# EAGLE design Stereo RDS Encoder-Analog Board (EAGLE 9.6.2)
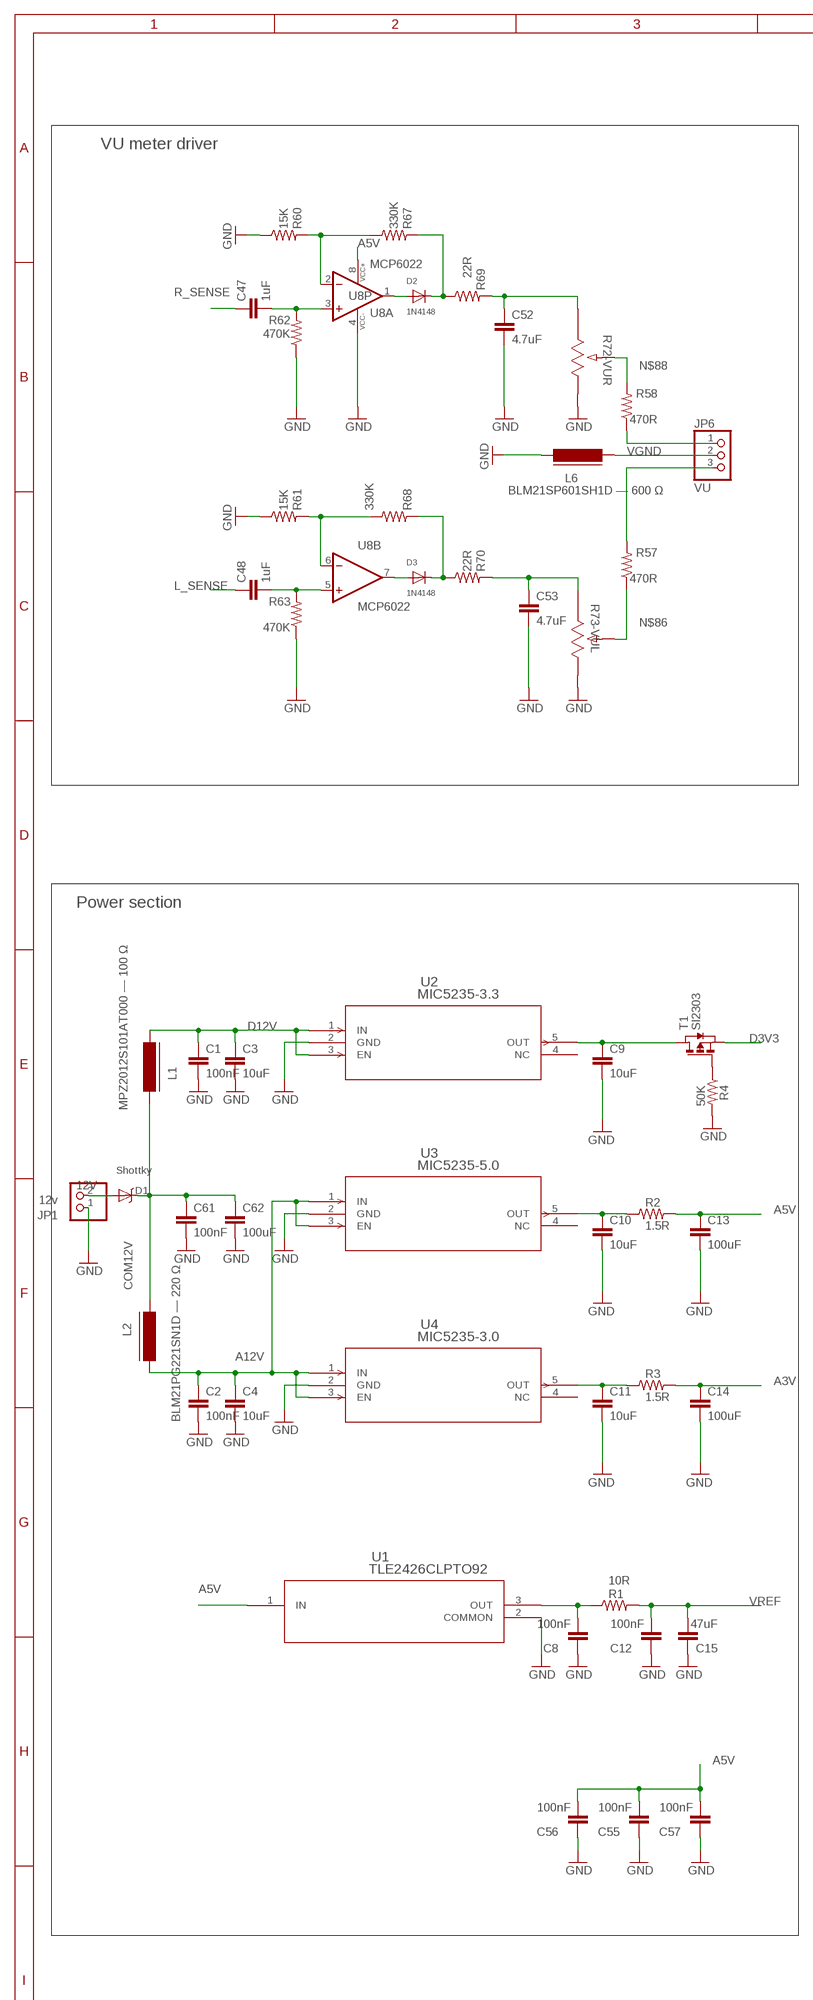
[diagram p0: schematic, sheet 1, part 1 of 2]
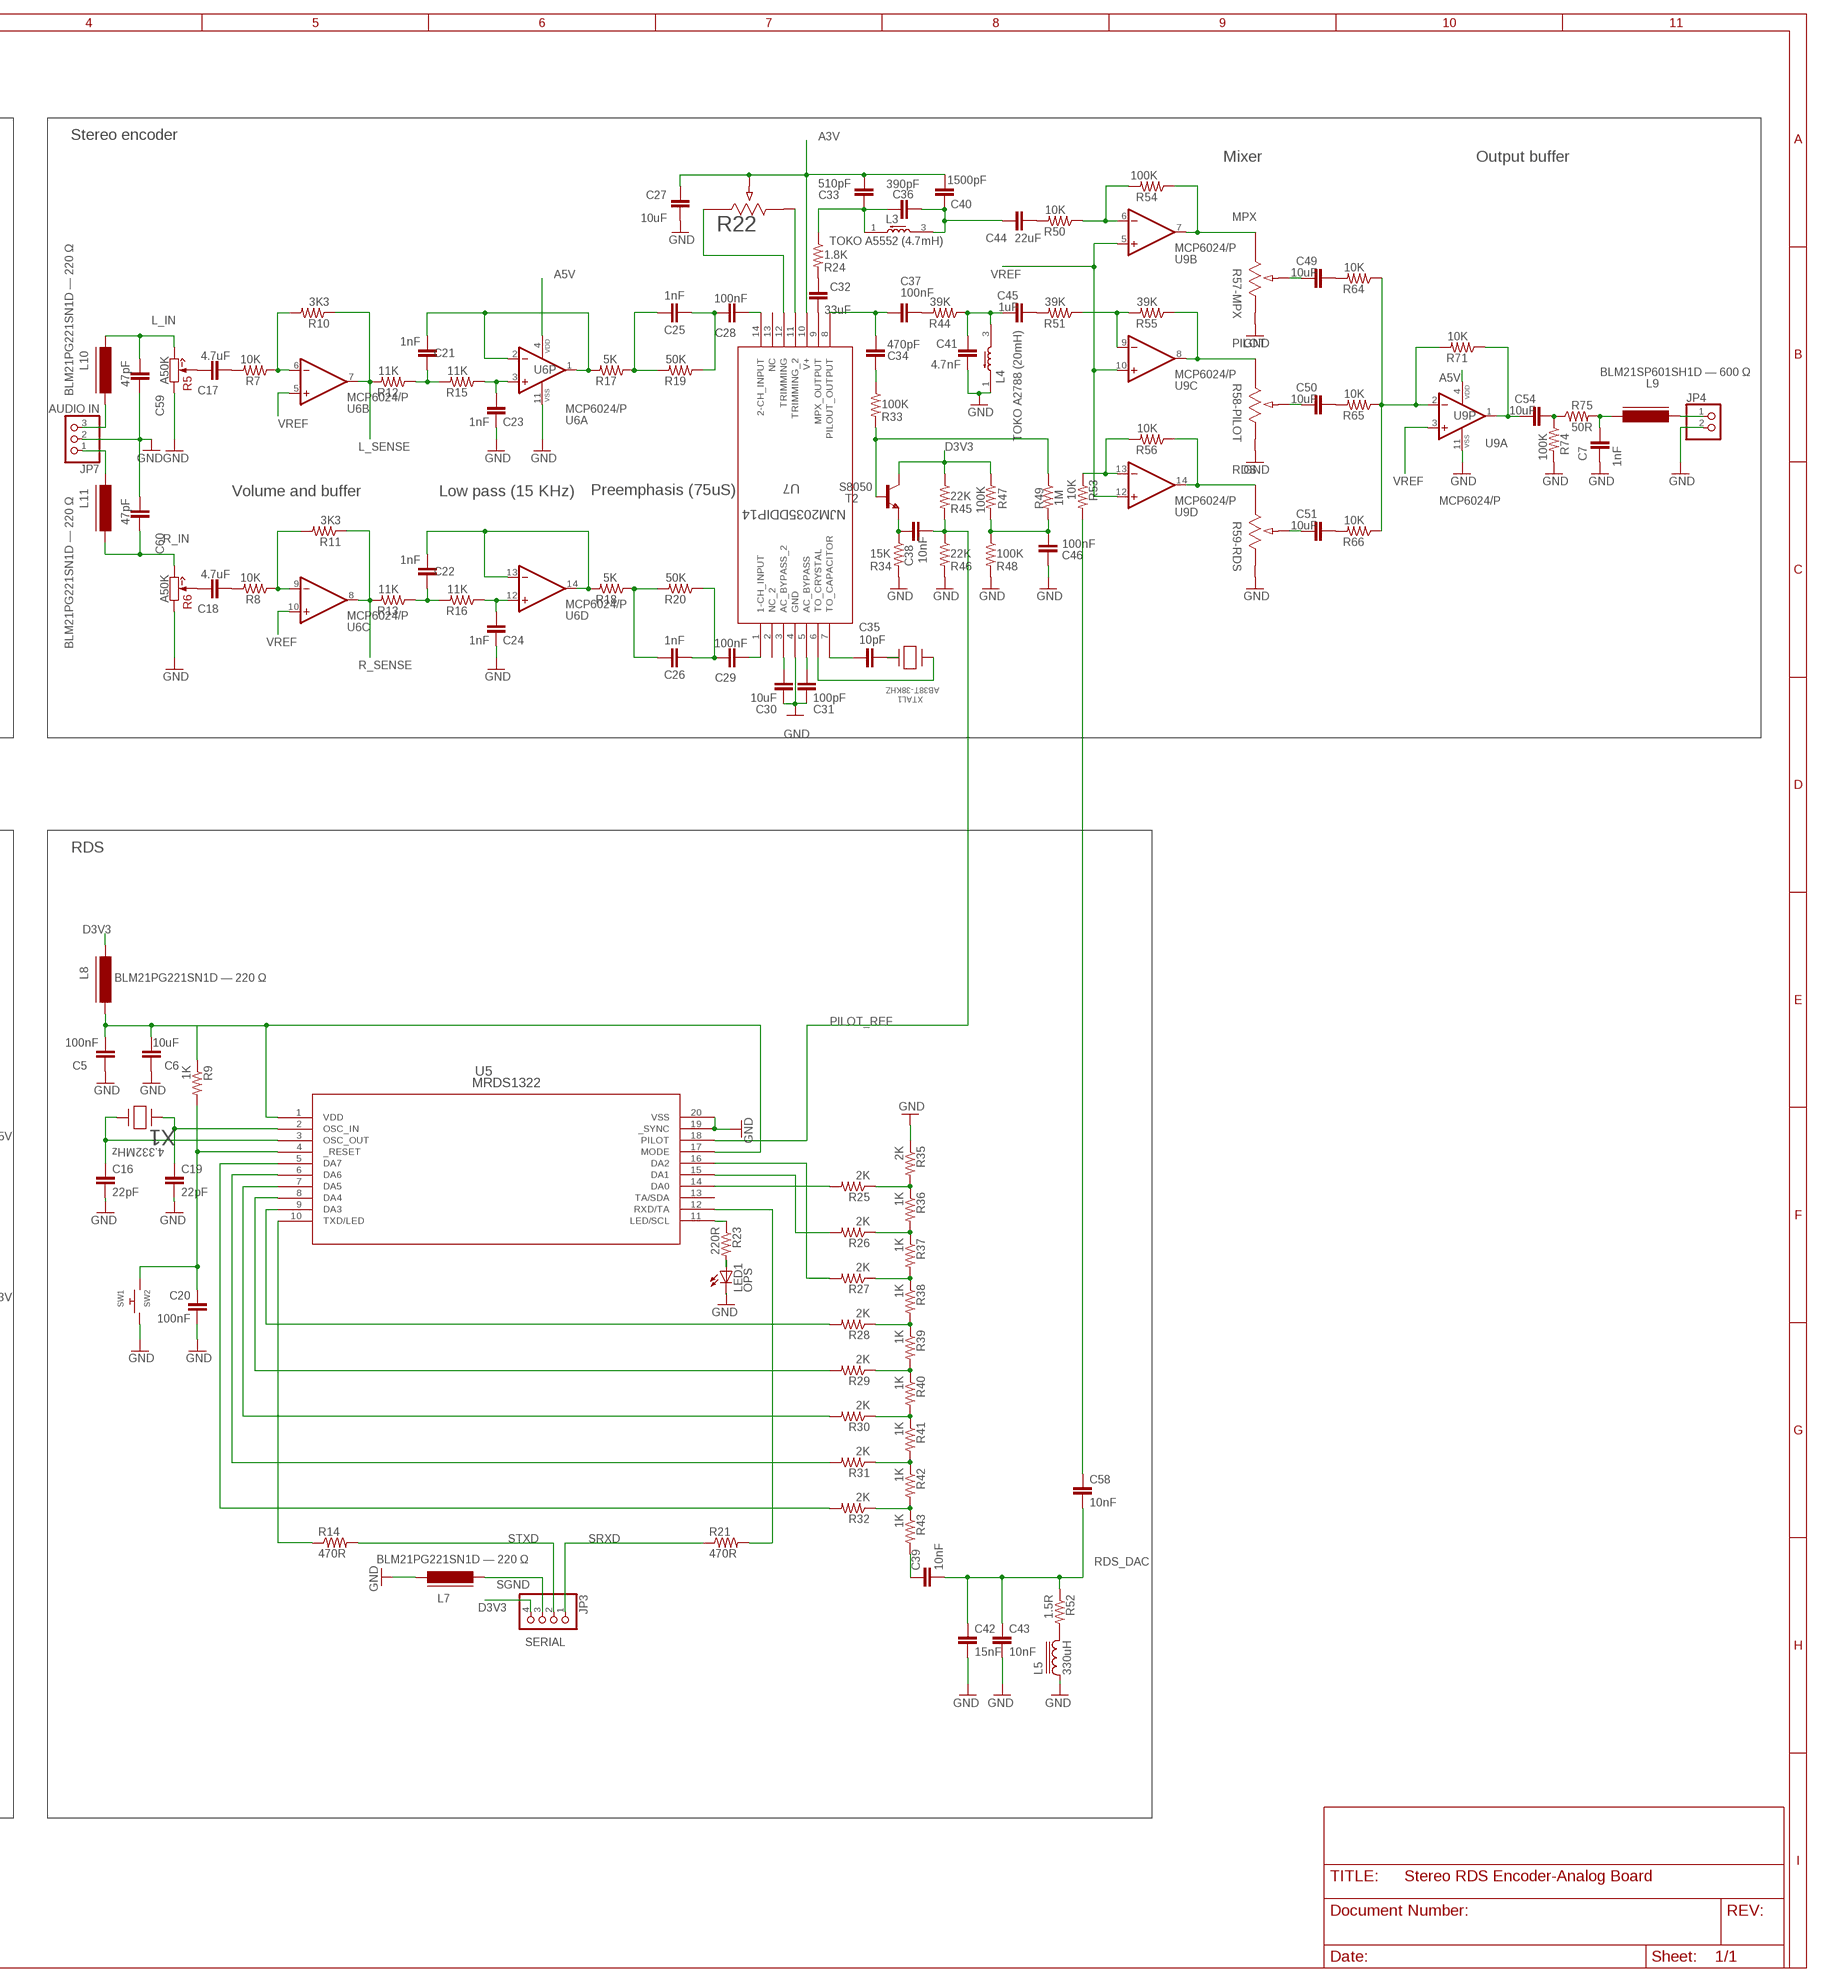
[diagram p1: schematic, sheet 1, part 2 of 2]

## Parts
C1  100nF  C-EUC0805  [C0805]
C2  100nF  C-EUC0805  [C0805]
C3  10uF  C-EUC0805  [C0805]
C4  10uF  C-EUC0805  [C0805]
C5  100nF  C-EUC0805  [C0805]
C6  10uF  C-EUC0805  [C0805]
C7  1nF  C-EUC0805  [C0805]
C8  100nF  C-EUC0805  [C0805]
C9  10uF  C-EUC0805  [C0805]
C10  10uF  C-EUC0805  [C0805]
C11  10uF  C-EUC0805  [C0805]
C12  100nF  C-EUC0805  [C0805]
C13  100uF  C-EUC0805  [C0805]
C14  100uF  C-EUC0805  [C0805]
C15  47uF  C-EUC0805  [C0805]
C16  22pF  C-EUC0805  [C0805]
C17  4.7uF  C-EUC0805  [C0805]
C18  4.7uF  C-EUC0805  [C0805]
C19  22pF  C-EUC0805  [C0805]
C20  100nF  C-EUC0805  [C0805]
C21  1nF  C-EUC0805  [C0805]
C22  1nF  C-EUC0805  [C0805]
C23  1nF  C-EUC0805  [C0805]
C24  1nF  C-EUC0805  [C0805]
C25  1nF  C-EUC0805  [C0805]
C26  1nF  C-EUC0805  [C0805]
C27  10uF  C-EUC0805  [C0805]
C28  100nF  C-EUC0805  [C0805]
C29  100nF  C-EUC0805  [C0805]
C30  10uF  C-EUC0805  [C0805]
C31  100pF  C-EUC0805  [C0805]
C32  33uF  C-EUC0805  [C0805]
C33  510pF  C-EUC0805  [C0805]
C34  470pF  C-EUC0805  [C0805]
C35  10pF  C-EUC0805  [C0805]
C36  390pF  C-EUC0805  [C0805]
C37  100nF  C-EUC0805  [C0805]
C38  10nF  C-EUC0805  [C0805]
C39  10nF  C-EUC0805  [C0805]
C40  1500pF  C-EUC0805  [C0805]
C41  4.7nF  C-EUC0805  [C0805]
C42  15nF  C-EUC0805  [C0805]
C43  10nF  C-EUC0805  [C0805]
C44  22uF  C-EUC0805  [C0805]
C45  1uF  C-EUC0805  [C0805]
C46  100nF  C-EUC0805  [C0805]
C47  1uF  C-EUC0805  [C0805]
C48  1uF  C-EUC0805  [C0805]
C49  10uF  C-EUC0805  [C0805]
C50  10uF  C-EUC0805  [C0805]
C51  10uF  C-EUC0805  [C0805]
C52  4.7uF  C-EUC0805  [C0805]
C53  4.7uF  C-EUC0805  [C0805]
C54  10uF  C-EUC0805  [C0805]
C55  100nF  C-EUC0805  [C0805]
C56  100nF  C-EUC0805  [C0805]
C57  100nF  C-EUC0805  [C0805]
C58  10nF  C-EUC0805  [C0805]
C59  47pF  C-EUC0805  [C0805]
C60  47pF  C-EUC0805  [C0805]
C61  100nF  C-EUC0805  [C0805]
C62  100uF  C-EUC0805  [C0805]
D1  Shottky  DIODE-SCHOTTKYSMA-403D  [SMA-403D]
D2  1N4148  DIODESOD-323F  [SOD-323F]
D3  1N4148  DIODESOD-323F  [SOD-323F]
JP1  12v  PINHD-1X2  [1X02]
JP3  SERIAL  PINHD-1X4  [1X04]
JP4  PINHD-1X2  [1X02]
JP6  VU  PINHD-1X3  [1X03]
JP7  AUDIO IN  PINHD-1X3  [1X03]
L1  MPZ2012S101AT000 — 100 Ω  FERRITE-0805  [FB805]
L2  BLM21PG221SN1D — 220 Ω  FERRITE-0805  [FB805]
L3  TOKO A5552 (4.7mH)  7KMM  [7KMM]
L4  TOKO A2788 (20mH)  7KMM  [7KMM]
L5  330uH  8RB  [8RB]
L6  BLM21SP601SH1D — 600 Ω  FERRITE-0805  [FB805]
L7  BLM21PG221SN1D — 220 Ω  FERRITE-0805  [FB805]
L8  BLM21PG221SN1D — 220 Ω  FERRITE-0805  [FB805]
L9  BLM21SP601SH1D — 600 Ω  FERRITE-0805  [FB805]
L10  BLM21PG221SN1D — 220 Ω  FERRITE-0805  [FB805]
L11  BLM21PG221SN1D — 220 Ω  FERRITE-0805  [FB805]
LED1  OPS  LEDCHIPLED_0805  [CHIPLED_0805]
R1  10R  R-US_M0805  [M0805]
R2  1.5R  R-US_M0805  [M0805]
R3  1.5R  R-US_M0805  [M0805]
R4  50K  R-US_M0805  [M0805]
R5  A50K  A10K(9MM)  [RV09-SINGLE]
R6  A50K  A10K(9MM)  [RV09-SINGLE]
R7  10K  R-US_M0805  [M0805]
R8  10K  R-US_M0805  [M0805]
R9  1K  R-US_M0805  [M0805]
R10  3K3  R-US_M0805  [M0805]
R11  3K3  R-US_M0805  [M0805]
R12  11K  R-US_M0805  [M0805]
R13  11K  R-US_M0805  [M0805]
R14  470R  R-US_M0805  [M0805]
R15  11K  R-US_M0805  [M0805]
R16  11K  R-US_M0805  [M0805]
R17  5K  R-US_M0805  [M0805]
R18  5K  R-US_M0805  [M0805]
R19  50K  R-US_M0805  [M0805]
R20  50K  R-US_M0805  [M0805]
R21  470R  R-US_M0805  [M0805]
R22  50K  3296W-1-503LF  [POT_3296W]
R23  220R  R-US_M0805  [M0805]
R24  1.8K  R-US_M0805  [M0805]
R25  2K  R-US_M0805  [M0805]
R26  2K  R-US_M0805  [M0805]
R27  2K  R-US_M0805  [M0805]
R28  2K  R-US_M0805  [M0805]
R29  2K  R-US_M0805  [M0805]
R30  2K  R-US_M0805  [M0805]
R31  2K  R-US_M0805  [M0805]
R32  2K  R-US_M0805  [M0805]
R33  100K  R-US_M0805  [M0805]
R34  15K  R-US_M0805  [M0805]
R35  2K  R-US_M0805  [M0805]
R36  1K  R-US_M0805  [M0805]
R37  1K  R-US_M0805  [M0805]
R38  1K  R-US_M0805  [M0805]
R39  1K  R-US_M0805  [M0805]
R40  1K  R-US_M0805  [M0805]
R41  1K  R-US_M0805  [M0805]
R42  1K  R-US_M0805  [M0805]
R43  1K  R-US_M0805  [M0805]
R44  39K  R-US_M0805  [M0805]
R45  22K  R-US_M0805  [M0805]
R46  22K  R-US_M0805  [M0805]
R47  100K  R-US_M0805  [M0805]
R48  100K  R-US_M0805  [M0805]
R49  1M  R-US_M0805  [M0805]
R50  10K  R-US_M0805  [M0805]
R51  39K  R-US_M0805  [M0805]
R52  1.5R  R-US_M0805  [M0805]
R53  10K  R-US_M0805  [M0805]
R54  100K  R-US_M0805  [M0805]
R55  39K  R-US_M0805  [M0805]
R56  10K  R-US_M0805  [M0805]
R57  470R  R-US_M0805  [M0805]
R57-MPX  50K  3296W-1-503LF  [POT_3296W]
R58  470R  R-US_M0805  [M0805]
R58-PILOT  50K  3296W-1-503LF  [POT_3296W]
R59-RDS  50K  3296W-1-503LF  [POT_3296W]
R60  15K  R-US_M0805  [M0805]
R61  15K  R-US_M0805  [M0805]
R62  470K  R-US_M0805  [M0805]
R63  470K  R-US_M0805  [M0805]
R64  10K  R-US_M0805  [M0805]
R65  10K  R-US_M0805  [M0805]
R66  10K  R-US_M0805  [M0805]
R67  330K  R-US_M0805  [M0805]
R68  330K  R-US_M0805  [M0805]
R69  22R  R-US_M0805  [M0805]
R70  22R  R-US_M0805  [M0805]
R71  10K  R-US_M0805  [M0805]
R72-VUR  50K  3296W-1-503LF  [POT_3296W]
R73-VUL  50K  3296W-1-503LF  [POT_3296W]
R74  100K  R-US_M0805  [M0805]
R75  50R  R-US_M0805  [M0805]
SW1  SW2  SWITCH_PUSHBUTTONC&K_KSS  [BTN_CK_KSS]
T1  SI2303  PMOSSOT23  [SOT-23]
T2  S8050  BC846  [SOT23]
U1  TLE2426CLPTO92  [TO92]
U2  MIC5235-3.3  MIC5235-1.8YM5-TRSOT-23-5_M5_MCH-M  [SOT-23-5_M5_MCH-M]
U3  MIC5235-5.0  MIC5235-1.8YM5-TRSOT-23-5_M5_MCH-M  [SOT-23-5_M5_MCH-M]
U4  MIC5235-3.0  MIC5235-1.8YM5-TRSOT-23-5_M5_MCH-M  [SOT-23-5_M5_MCH-M]
U5  MRDS1322  [PDIP20_300MC_MCH]
U6  MCP6024/P  [DIL14]
U7  NJM2035DDIP14  [DIP14]
U8  MCP6022  TL072P  [DIL08]
U9  MCP6024/P  [DIL14]
X1  4.332MHz  HC-49/U-S15000000ABJB  [XTAL_HC-49/U-S_CFC]
XTAL1  AB38T-38KHZ  AB38T-32.768KHZ  [XTAL_AB38T_ABR]

## Nets
12V: D1.A JP1.2
A3V: C14.1 C27.1 C33.1 C40.1 R3.2 R22.2 U7.10(V+)
A5V: C13.1 C55.2 C56.2 C57.2 R2.2 U1.1(IN) U6.4(P:VDD) U8.8(P:VCC+) U9.4(P:VDD)
A12V: C2.1 C4.1 L2.2 U3.1(IN) U3.3(EN) U4.1(IN) U4.3(EN)
COM12V: C61.1 C62.1 D1.C L1.1 L2.1
D3V3: JP3.4 L8.1 R45.1 R47.1 T1.2(S) T2.3(C)
D12V: C1.1 C3.1 L1.2 U2.1(IN) U2.3(EN)
GND: C1.2 C2.2 C3.2 C4.2 C5.1 C6.1 C7.1 C8.1 C9.2 C10.2 C11.2 C12.1 C13.2 C14.2 C15.1 C16.2 C19.2 C20.2 C23.1 C24.1 C27.2 C30.1 C31.1 C41.1 C42.2 C43.2 C46.1 C52.2 C53.2 C55.1 C56.1 C57.1 C59.1 C60.2 C61.2 C62.2 JP1.1 JP4.2 JP7.2 L4.1(L1) L5.1 L6.1 L7.1 LED1.C R4.2 R5.1(CCW) R6.1(CCW) R34.2 R35.1 R46.2 R48.2 R57-MPX.3 R58-PILOT.3 R59-RDS.3 R60.1 R61.1 R62.1 R63.1 R72-VUR.3 R73-VUL.3 R74.2 SW1.P$2 U1.2(COMMON) U2.2(GND) U3.2(GND) U4.2(GND) U5.19(_SYNC) U5.20(VSS) U6.11(P:VSS) U7.4(GND) U8.4(P:VCC-) U9.11(P:VSS)
L_IN: C59.2 L10.1 R5.3(CW)
L_SENSE: C48.1 R10.1 R12.2 U6.7(B:OUT)
MPX: R54.1 R57-MPX.1 U9.7(B:OUT)
N#222: C9.1 T1.1(D) U2.5(OUT)
N$1: C16.1 U5.3(OSC_OUT) X1.2
N$2: C19.1 U5.2(OSC_IN) X1.1
N$3: R23.1 U5.11(LED/SCL)
N$4: R25.1 R35.2 R36.1
N$5: R26.1 R36.2 R37.1
N$6: R27.1 R37.2 R38.1
N$7: R28.1 R38.2 R39.1
N$8: R29.1 R39.2 R40.1
N$9: R30.1 R40.2 R41.1
N$10: R31.1 R41.2 R42.1
N$11: R32.1 R42.2 R43.1
N$12: R25.2 U5.14(DA0)
N$13: R26.2 U5.15(DA1)
N$14: R27.2 U5.16(DA2)
N$15: R28.2 U5.9(DA3)
N$16: R29.2 U5.8(DA4)
N$17: R30.2 U5.7(DA5)
N$18: R31.2 U5.6(DA6)
N$19: R32.2 U5.5(DA7)
N$20: C39.1 R43.2
N$21: R22.3 U7.11(TRIMMING_2)
N$22: R60.2 R67.1 U8.2(A:-IN)
N$23: LED1.A R23.2
N$24: D2.A U8.1(A:OUT)
N$25: D2.C R67.2 R69.1
N$26: C47.2 R62.2 U8.3(A:+IN)
N$27: C17.1 R5.2(W)
N$28: R61.2 R68.1 U8.6(B:-IN)
N$29: C17.2 R7.2
N$30: R7.1 R10.2 U6.6(B:-IN)
N$31: C8.2 R1.1 U1.3(OUT)
N$32: C21.1 R12.1 R15.2
N$33: C23.2 R15.1 U6.3(A:+IN)
N$34: C21.2 R17.2 U6.1(A:OUT) U6.2(A:-IN)
N$35: C25.2 R17.1 R19.2
N$36: C25.1 C28.1 R19.1
N$37: C28.2 U7.14(2-CH_INPUT)
N$38: C18.1 R6.2(W)
N$39: C18.2 R8.2
N$40: R8.1 R11.2 U6.9(C:-IN)
N$41: C11.1 R3.1 U4.5(OUT)
N$42: C22.1 R13.1 R16.2
N$43: C24.2 R16.1 U6.12(D:+IN)
N$44: C22.2 R18.2 U6.13(D:-IN) U6.14(D:OUT)
N$45: C26.2 R18.1 R20.2
N$46: C26.1 C29.1 R20.1
N$47: C29.2 U7.1(1-CH_INPUT)
N$48: C30.2 U7.3(AC_BYPASS_2)
N$49: C31.2 U7.5(AC_BYPASS)
N$50: C35.2 U7.7(TO_CAPACITOR)
N$51: C35.1 XTAL1.2
N$52: U7.6(TO_CRYSTAL) XTAL1.1
N$53: R22.1 U7.12(TRIMMING)
N$54: D3.A U8.7(B:OUT)
N$55: C41.2 C45.1 L4.3(L2) R44.1
N$56: C34.1 C37.2 U7.8(PILOUT_OUTPUT)
N$57: C37.1 R44.2
N$58: C32.2 U7.9(MPX_OUTPUT)
N$59: C32.1 R24.2
N$60: C33.2 C36.1 L3.1(L1) R24.1
N$61: R51.1 R55.2 U9.9(C:-IN)
N$62: R50.1 R54.2 U9.6(B:-IN)
N$63: R53.1 R56.2 U9.13(D:-IN)
N$64: C44.2 R50.2
N$65: C45.2 R51.2
N$66: C49.1 R57-MPX.2
N$67: C50.1 R58-PILOT.2
N$68: C51.1 R59-RDS.2
N$69: C49.2 R64.2
N$70: C50.2 R65.2
N$71: C51.2 R66.2
N$72: R64.1 R65.1 R66.1 R71.2 U9.2(A:-IN)
N$73: D3.C R68.2 R70.1
N$74: C34.2 R33.1
N$75: C58.1 R53.2
N$76: C52.1 R69.2 R72-VUR.1
N$77: C53.1 R70.2 R73-VUL.1
N$78: L5.2 R52.2
N$79: C54.1 R71.1 U9.1(A:OUT)
N$80: JP7.3 L10.2
N$81: JP7.1 L11.1
N$82: C10.1 R2.1 U3.5(OUT)
N$83: R33.2 R49.1 T2.1(B)
N$84: C46.2 R47.2 R48.1 R49.2
N$85: R4.1 T1.3(G)
N$86: R57.1 R73-VUL.2
N$87: C38.1 R34.1 T2.2(E)
N$88: R58.2 R72-VUR.2
N$89: C54.2 R74.1 R75.1
N$90: C7.2 L9.2 R75.2
N$91: JP4.1 L9.1
N$99: C36.2 C40.2 C44.1 L3.3(L2)
N$277: C48.2 R63.2 U8.5(B:+IN)
PIC3V3: C5.2 C6.2 L8.2 R9.1 U5.1(VDD) U5.17(MODE)
PILOT: R55.1 R58-PILOT.1 U9.8(C:OUT)
PILOT_REF: C38.2 R45.2 R46.1 U5.18(PILOT)
R_IN: C60.1 L11.2 R6.3(CW)
R_SENSE: C47.1 R11.1 R13.2 U6.8(C:OUT)
RDS: R56.1 R59-RDS.1 U9.14(D:OUT)
RDS_DAC: C39.2 C42.1 C43.1 C58.2 R52.1
RST: C20.1 R9.2 SW1.P$1 U5.4(_RESET)
RXD: R21.2 U5.12(RXD/TA)
SGND: JP3.3 L7.2
SRXD: JP3.1 R21.1
STXD: JP3.2 R14.2
TXD: R14.1 U5.10(TXD/LED)
VGND: JP6.2 L6.2
VREF: C12.2 C15.2 R1.2 U6.5(B:+IN) U6.10(C:+IN) U9.3(A:+IN) U9.5(B:+IN) U9.10(C:+IN) U9.12(D:+IN)
VU_L: JP6.3 R57.2
VU_R: JP6.1 R58.1
Unconnected: L3.S1 L3.S2 L4.S1 L4.S2 U2.4(NC) U3.4(NC) U4.4(NC) U5.13(TA/SDA) U7.2(NC_2) U7.13(NC)

## Notes on the sheet
- VU meter driver | Stereo encoder
- Mixer | Output buffer
- Volume and buffer | Low pass (15 KHz) | Preemphasis (75uS)
- Power section | RDS

## Library data of the parts
C1-C62 = rcl:C-EU: CAPACITOR, European symbol
D1 = Ai_DiscreteSemis:DIODE-SCHOTTKY: Commonly MBRA140.
D2 D3 = adafruit:DIODE: Diode SMADIODE - SMA Surface Mount Package 20V 1A Schottky Diode Digikey: 641-1014-6-ND DO-1N4148 - Through Hole Small Current Diode SOD-123 20V 1 A (.5mV Vf) Schottky Diode - Digikey: MBRX120TPMSCT-ND SOD-323 10V 570mA (.38mV Vf, 3ns) Schottky Diode - Digikey: ZLLS410CT-ND SOD-523 30V 30mA Schottky Diode (RB751S-40TE61) - Digikey: RB751S-40TE61CT-ND SOT23-R/W - SOT23 Package (R = Solder Paste/Reflow Ovens, W = Hand-Soldering) BAT54Film 40V 300mA - Digikey: 497-7162-1-ND
JP1 JP4 = pinhead:PINHD-1X2: PIN HEADER
JP3 = pinhead:PINHD-1X4: PIN HEADER
JP6 JP7 = pinhead:PINHD-1X3: PIN HEADER
L1 L2 L6-L11 = Dangerous Prototypes_devices:FERRITE: Ferrite bead in various packages
L3 L4 = inductor-toko:7KMM: TUNEABLE COIL 7 MM TOKO 7KMM Series
L5 = inductor-toko:8RB: Type 8RB Fixed Inductor 5 mm (ls), 8 mm (dia)
LED1 = adafruit:LED: LED OSRAM: - CHIPLED LG R971, LG N971, LY N971, LG Q971, LY Q971, LO R971, LY R971 LH N974, LH R974 LS Q976, LO Q976, LY Q976 LO Q996 - Hyper CHIPLED LW Q18S LB Q993, LB Q99A, LB R99A - SideLED LS A670, LO A670, LY A670, LG A670, LP A670 LB A673, LV A673, LT A673, LW A673 LH A674 LY A675 LS A676, LA A676, LO A676, LY A676, LW A676 LS A679, LY A679, LG A679 - Hyper Micro SIDELED® LS Y876, LA Y876, LO Y876, LY Y876 LT Y87S - SmartLED LW L88C, LW L88S LB L89C, LB L89S, LG L890 LS L89K, LO L89K, LY L89K LS L896, LA L896, LO L896, LY L896 - TOPLED LS T670, LO T670, LY T670, LG T670, LP T670 LSG T670, LSP T670, LSY T670, LOP T670, LYG T670 LG T671, LOG T671, LSG T671 LB T673, LV T673, LT T673, LW T673 LH T674 LS T676, LA T676, LO T676, LY T676, LB T676, LH T676, LSB T676, LW T676 LB T67C, LV T67C, LT T67C, LS T67K, LO T67K, LY T67K, LW E67C LS E67B, LA E67B, LO E67B, LY E67B, LB E67C, LV E67C, LT E67C LW T67C LS T679, LY T679, LG T679 LS T770, LO T770, LY T770, LG T770, LP T770 LB T773, LV T773, LT T773, LW T773 LH T774 LS E675, LA E675, LY E675, LS T675 LS T776, LA T776, LO T776, LY T776, LB T776 LHGB T686 LT T68C, LB T68C - Hyper Mini TOPLED® LB M676 - Mini TOPLED Santana® LG M470 LS M47K, LO M47K, LY M47K Source: http://www.osram.convergy.de/
R1-R4 R7-R21 R23-R58 R60-R71 R74 R75 = adafruit:R-US_: RESISTOR, American symbol
R5 R6 = potentiometers:?; MOUSER: 652-PTV09A4025FA103
R22 R57-MPX R58-PILOT R59-RDS R72-VUR R73-VUL = Bourns 3296W trimmer:3296W-1-503LF; COPYRIGHT: Copyright (C) 2025 Ultra Librarian. All rights reserved.; MANUFACTURER_NAME: Bourns Electronics; MANUFACTURER_PART_NUMBER: 3296W-1-503LF
SW1 = adafruit:SWITCH_PUSHBUTTON: Buttons SOFTTOUCHSMD_SJ - Soft touch temporary push button (Super Junk Akihabara) Compatible with SKPMANE010 [Mouser: 688-SKPMAN] C&K_KSS = Digikey: KSS221GLFS
T1 = zetex:PMOSSOT23: MOS FET; OC_FARNELL: unknown; OC_NEWARK: unknown
T2 = transistor:BC846: NPN TRANSISTOR
U1 = TLE 2426:TLE2426CLP
U2-U4 = MIC5235-1-8YM5-TR:MIC5235-1.8YM5-TR; COPYRIGHT: Copyright (C) 2025 Ultra Librarian. All rights reserved.; MANUFACTURER_PART_NUMBER: MIC5235-1.8YM5-TR; MFR_NAME: Microchip
U5 = MRDS1322:MRDS1322; COPYRIGHT: Copyright (C) 2025 Ultra Librarian. All rights reserved.; MANUFACTURER_NAME: Microchip; MANUFACTURER_PART_NUMBER: PIC16F1509-E/P
U6 U9 = op-amp:MCP6024: OP-AMP 2.5V to 5.5V Rail-to-Rail
U7 = NJM2035D:NJM2035D
U8 = op-amp:TL072: JFET OP-AMP - Dual
X1 = HC49US:HC-49/U-S15000000ABJB; COPYRIGHT: Copyright (C) 2025 Ultra Librarian. All rights reserved.; MANUFACTURER_NAME: Citizen; MANUFACTURER_PART_NUMBER: HC-49/U-S15000000ABJB
XTAL1 = AB38T resonator:AB38T-32.768KHZ; COPYRIGHT: Copyright (C) 2025 Ultra Librarian. All rights reserved.; MANUFACTURER_NAME: Abracon; MANUFACTURER_PART_NUMBER: AB38T-32.768KHZ

## Net classes
2 hipower: width 0.813 mm

## Board
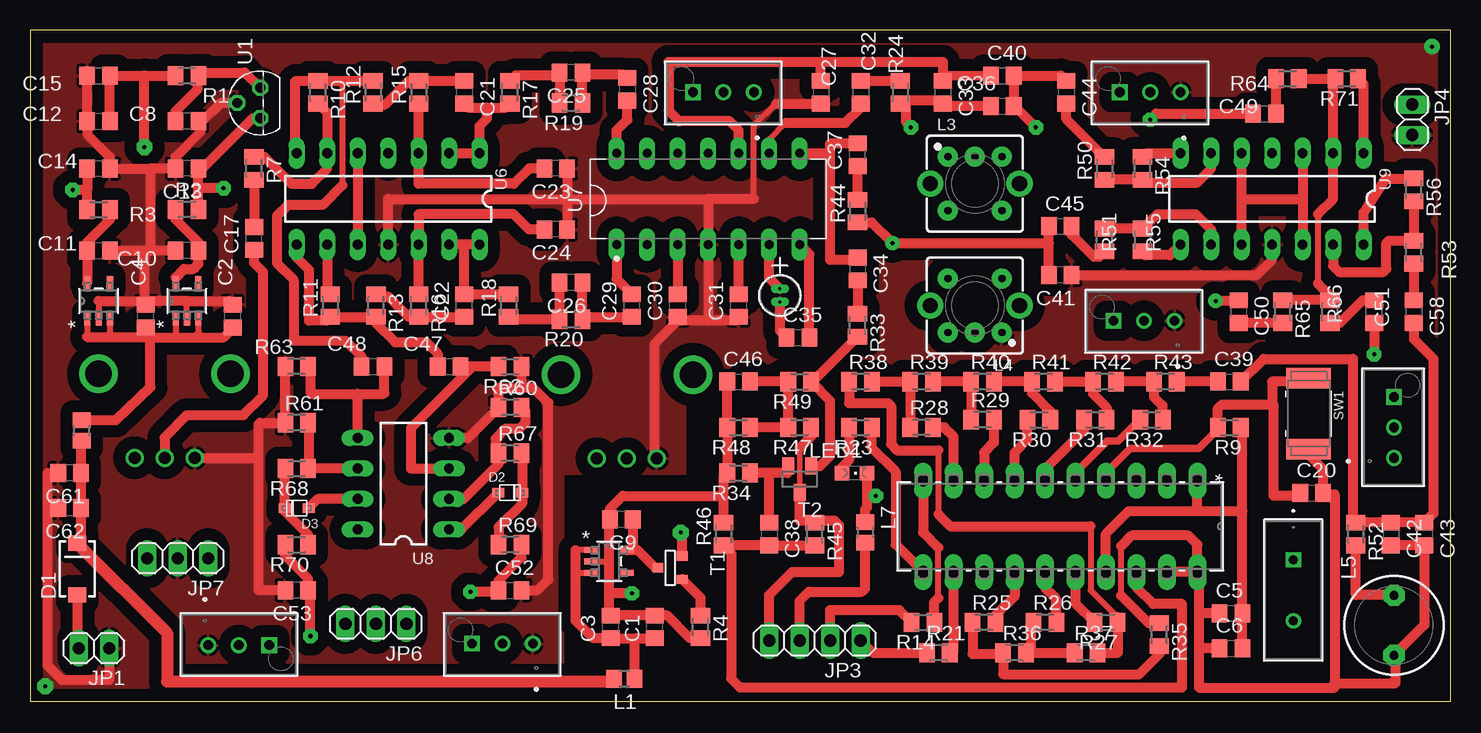
[diagram p2: board, top side]
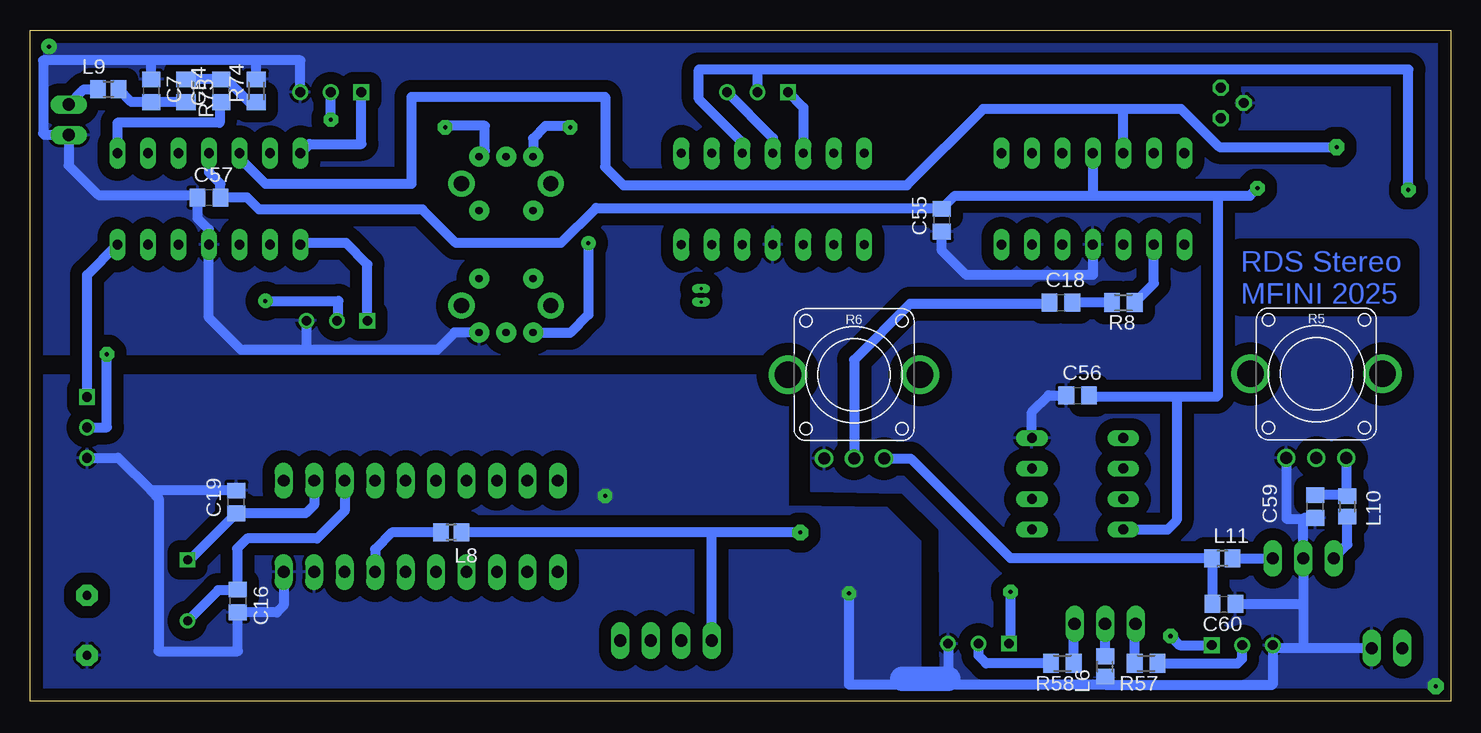
[diagram p3: board, bottom side, seen from below]

Size 118.42 x 56 mm. Coordinates in mm from the lower left corner, seen from the top.
Outline: 0,0 118.42,0 118.42,56 0,56 0,0
Copper layers (1*16): Top 0.035mm / dielectric 1.5mm / Bottom 0.035mm
Design rules "default": minimum track width 6mil, minimum drill 0.35mm, track to track 6mil, track to pad 6mil, pad to pad 6mil, via to via 6mil, smd to smd 6mil, copper to edge 40mil, drill to drill 6mil, minimum pad ring 10mil, minimum via ring 8mil, stop-mask expansion 4mil, vias tented up to drill 0mil, thermal gap 10mil

### Footprints (pad centres in the part's own frame; a part is rotated, then mirrored left to right if it is on the bottom)
C0805 = smd 1.3 x 1.5: 1 -0.95,0; 2 0.95,0
SMA-403D = smd 1.27 x 1.47: A -2.15,0; C 2.15,0
SOD-323F = smd 1 x 0.8: A -1,0; C 1,0
1X02 = drill 1.016 long: 1 -1.27,0; 2 1.27,0
1X04 = drill 1.016 long: 1 -3.81,0; 2 -1.27,0; 3 1.27,0; 4 3.81,0
1X03 = drill 1.016 long: 1 -2.54,0; 2 0,0; 3 2.54,0
FB805 = smd 1.3 x 1.5: 1 -0.85,0; 2 0.85,0
7KMM = drill 0.61 pad 1.676: 1 -2.25,-2.25; 2 -2.25,0; 3 -2.25,2.25; 4 2.25,2.25; 6 2.25,-2.25 | drill 1.27 pad 2.184: S1 0,-3.725; S2 0,3.725
8RB = drill 0.711 pad 1.778 octagon: 1 -2.5,0; 2 2.5,0
CHIPLED_0805 = smd 1.2 x 1.2: A 0,-1.05; C 0,1.05
M0805 = smd 1.3 x 1.6: 1 -0.95,0; 2 0.95,0
RV09-SINGLE = drill 1: 1 -2.5,-7; 2 0,-7; 3 2.5,-7 | drill 2.2: GND@1 -5.5,0; GND@2 5.5,0
POT_3296W = drill 0.813 pad 1.321 square: 1 0,0 | drill 0.813 pad 1.321: 2 2.54,0; 3 5.08,0
BTN_CK_KSS = smd 1.7 x 3.7: P$1 -2.95,0; P$2 2.95,0
SOT-23 = smd 0.787 x 0.889: 1 0.025,-1.016; 2 -0.94,1.016; 3 0.991,1.016
SOT23 = smd 1 x 1.4: 1 -0.95,-1.1; 2 0.95,-1.1; 3 0,1.1
TO92 = drill 0.813 octagon: 1 -1.27,0; 2 0,1.905; 3 1.27,0
SOT-23-5_M5_MCH-M = smd 1.181 x 0.508: 1 -1.467,0.95; 2 -1.467,0; 3 -1.467,-0.95; 4 1.467,-0.95; 5 1.467,0.95
PDIP20_300MC_MCH = drill 0.991 pad 1.499 long: 1 0,0; 2 0,-2.54; 3 0,-5.08; 4 0,-7.62; 5 0,-10.16; 6 0,-12.7; 7 0,-15.24; 8 0,-17.78; 9 0,-20.32; 10 0,-22.86; 11 7.62,-22.86; 12 7.62,-20.32; 13 7.62,-17.78; 14 7.62,-15.24; 15 7.62,-12.7; 16 7.62,-10.16; 17 7.62,-7.62; 18 7.62,-5.08; 19 7.62,-2.54; 20 7.62,0
DIL14 = drill 0.813 long: 1 -7.62,-3.81; 2 -5.08,-3.81; 3 -2.54,-3.81; 4 0,-3.81; 5 2.54,-3.81; 6 5.08,-3.81; 7 7.62,-3.81; 8 7.62,3.81; 9 5.08,3.81; 10 2.54,3.81; 11 0,3.81; 12 -2.54,3.81; 13 -5.08,3.81; 14 -7.62,3.81
DIP14 = drill 0.743 pad 1.343 long: 1 -3.81,7.62; 2 -3.81,5.08; 3 -3.81,2.54; 4 -3.81,0; 5 -3.81,-2.54; 6 -3.81,-5.08; 7 -3.81,-7.62; 8 3.81,-7.62; 9 3.81,-5.08; 10 3.81,-2.54; 11 3.81,0; 12 3.81,2.54; 13 3.81,5.08; 14 3.81,7.62
DIL08 = drill 0.813 long: 1 -3.81,-3.81; 2 -1.27,-3.81; 3 1.27,-3.81; 4 3.81,-3.81; 5 3.81,3.81; 6 1.27,3.81; 7 -1.27,3.81; 8 -3.81,3.81
XTAL_HC-49/U-S_CFC = drill 0.762 pad 1.27 square: 1 0,0 | drill 0.762 pad 1.27: 2 5.08,0
XTAL_AB38T_ABR = drill 0.25 pad 0.61 long: 1 0,0; 2 1.092,0

### Placement (x,y rotation side)
C1  52.07,6.22 90 top
C2  16.89,32.13 90 top
C3  48.39,6.22 90 top
C4  9.65,32.13 90 top
C5  100.08,7.37 0 top
C6  100.08,4.45 0 top
C7  108.33,50.93 270 bottom
C8  13.08,48.39 180 top
C9  49.28,15.17 180 top
C10  13.08,37.59 180 top
C11  5.71,37.59 0 top
C12  5.71,48.39 0 top
C13  13.08,44.45 180 top
C14  5.71,44.45 0 top
C15  5.71,52.2 0 top
C16  101.09,8.38 270 bottom
C17  18.67,38.61 90 top
C18  32.51,33.27 0 bottom
C19  101.22,16.64 90 bottom
C20  106.81,17.4 0 top
C21  36.2,50.8 270 top
C22  36.2,33.02 90 top
C23  43.81,44.45 180 top
C24  43.81,39.37 180 top
C25  45.09,52.45 180 top
C26  45.09,34.92 180 top
C27  65.91,50.8 270 top
C28  49.78,51.05 270 top
C29  50.16,33.02 90 top
C30  53.98,33.02 90 top
C31  59.05,33.02 90 top
C32  69.22,50.8 270 top
C33  76.07,50.8 270 top
C34  68.96,36.07 270 top
C35  64.01,30.35 0 top
C36  81.03,49.66 0 top
C37  68.96,45.59 90 top
C38  61.59,13.97 270 top
C39  99.95,26.67 0 top
C40  81.03,52.2 0 top
C41  85.85,35.56 180 top
C42  113.41,13.97 270 top
C43  116.2,13.97 270 top
C44  86.36,50.8 270 top
C45  85.85,39.62 0 top
C46  59.05,26.67 0 top
C47  34.92,27.94 0 top
C48  28.57,27.94 0 top
C49  102.87,49.02 0 top
C50  100.71,32.51 270 top
C51  112.01,32.51 90 top
C52  40.01,9.27 0 top
C53  22.23,9.27 180 top
C54  102.49,50.93 90 bottom
C55  42.42,40.13 90 bottom
C56  31.11,25.53 0 bottom
C57  103.5,42.04 0 bottom
C58  115.32,32.51 270 top
C59  11.3,16.26 90 bottom
C60  18.92,8.13 0 bottom
C61  3.3,19.05 180 top
C62  3.3,16.13 180 top
D1  3.94,11.05 90 top
D2  40.01,17.4 0 top
D3  22.23,16.13 180 top
JP1  5.33,4.45 180 top
JP3  65.41,5.08 180 top
JP4  115.19,48.51 270 top
JP6  28.83,6.48 180 top
JP7  12.32,11.94 180 top
L1  49.53,1.91 0 top
L2  4.32,22.61 90 top
L3  78.74,43.18 270 top
L4  78.74,33.02 90 top
L5  113.67,6.35 90 top
L6  28.83,2.92 90 bottom
L7  69.6,14.1 270 top
L8  83.31,14.1 180 bottom
L9  111.89,51.05 0 bottom
L10  8.64,16.26 270 bottom
L11  19.05,11.94 180 bottom
LED1  68.71,19.05 270 top
R1  13.08,52.2 180 top
R2  13.08,41.02 0 top
R3  5.71,41.02 180 top
R4  55.88,6.22 270 top
R5  11.21,27.32 0 bottom
R6  49.74,27.26 0 bottom
R7  18.67,44.45 270 top
R8  27.3,33.27 180 bottom
R9  99.95,22.86 180 top
R10  24,50.8 270 top
R11  25.02,33.02 90 top
R12  28.57,50.8 90 top
R13  28.83,33.02 270 top
R14  74.42,6.6 180 top
R15  32.38,50.8 90 top
R16  32.38,33.02 270 top
R17  40.01,50.8 270 top
R18  39.88,33.02 90 top
R19  45.09,49.91 180 top
R20  45.09,31.88 180 top
R21  75.69,4.06 0 top
R22  55.24,50.8 0 top
R23  69.22,22.86 180 top
R24  72.52,50.8 90 top
R25  79.5,6.6 0 top
R26  84.58,6.6 0 top
R27  89.66,6.6 180 top
R28  74.3,22.86 0 top
R29  79.38,23.5 0 top
R30  84.07,23.5 180 top
R31  88.77,23.5 180 top
R32  93.47,23.5 180 top
R33  68.96,31.37 270 top
R34  59.05,19.05 180 top
R35  94.11,5.59 270 top
R36  82.04,4.06 0 top
R37  88.01,4.06 0 top
R38  69.22,26.67 0 top
R39  74.3,26.67 0 top
R40  79.38,26.67 0 top
R41  84.45,26.67 0 top
R42  89.53,26.67 0 top
R43  94.61,26.67 0 top
R44  68.96,40.89 90 top
R45  65.41,13.97 270 top
R46  57.78,13.97 90 top
R47  64.14,22.86 180 top
R48  59.05,22.86 180 top
R49  64.14,26.67 180 top
R50  89.53,44.45 90 top
R51  89.53,38.48 270 top
R52  110.49,13.97 270 top
R53  115.32,37.47 270 top
R54  92.71,44.45 270 top
R55  92.71,38.48 90 top
R56  115.32,42.67 270 top
R57  25.4,3.17 180 bottom
R57-MPX  90.81,50.8 0 top
R58  32.38,3.17 180 bottom
R58-PILOT  90.3,31.75 0 top
R59-RDS  113.67,25.4 270 top
R60  40.01,24.51 0 top
R61  22.23,23.24 0 top
R62  40.01,27.94 180 top
R63  22.23,27.94 0 top
R64  104.78,51.94 180 top
R65  104.39,32.51 270 top
R66  108.33,32.51 270 top
R67  40.01,20.7 0 top
R68  22.23,19.43 180 top
R69  40.01,13.08 0 top
R70  22.23,13.08 180 top
R71  109.73,51.94 180 top
R72-VUR  36.83,4.83 0 top
R73-VUL  19.94,4.7 180 top
R74  99.57,50.93 90 bottom
R75  105.41,50.93 270 bottom
SW1  106.55,24 270 top
T1  53.34,11.18 270 top
T2  64.14,18.54 180 top
U1  19.18,49.91 90 top
U2  48.26,11.68 0 top
U3  13.08,33.4 90 top
U4  5.71,33.4 90 top
U5  97.28,18.41 270 top
U6  29.84,41.91 180 top
U7  56.52,41.91 90 top
U8  31.11,18.16 90 top
U9  103.5,41.91 180 top
X1  105.28,11.81 270 top
XTAL1  62.48,34.42 270 top

### Tracks (layer width: path | path; a pad name or v marks a point on that pad's centre or on a via)
12V
  Top 0.813: JP1.2 4.06,5.46 3.94,5.59 D1.A
A3V  (via drill 0.35 pad 1.2)
  Top 0.813: U7.10 59.05,47.62 58.29,48.39 54.1,48.39 53.21,49.28 53.21,53.34 65.91,53.34 | C40.1 76.45,52.13 C33.1 76.07,53.34 65.91,53.34 | C27.1 65.91,53.34 | R3.2 4.76,42.67 | C14.1 4.76,42.67 | v3.56,42.67 4.76,42.67
  Bottom 0.813: U7.10 59.05,46.61 62.67,50.23 62.67,52.7 57.78,52.7 | 57.78,52.7 3.56,52.7 v3.56,42.67 | R22.2 57.78,52.7
A5V  (via drill 0.35 pad 1.2)
  Top 0.813: R2.2 14.03,42.8 | 14.03,42.8 C13.1 14.35,44.45 18.54,48.64 U1.1 | v16.13,42.8 14.03,42.8
  Bottom 0.813: U8.8 23.62,14.35 22.86,15.11 22.86,25.4 | 29.72,42.16 41.34,42.16 C55.2 42.48,41.15 71.25,41.15 74.17,38.23 82.93,38.23 85.72,41.02 99.31,41.02 100.33,42.04 C57.2 102.56,43.18 103.5,44.13 U9.4 | 29.72,42.16 19.56,42.16 | 29.72,42.16 29.84,42.29 U6.4 | 19.56,42.16 19.43,42.04 19.43,25.53 19.56,25.4 22.86,25.4 | v16.13,42.8 16.76,42.16 19.56,42.16 | 22.86,25.4 30.04,25.4 C56.2
A12V
  Top 0.508: U4.3 6.67,30.55 | U3.1 12.13,30.42 | U3.3 14.03,30.54 | U4.1 4.76,30.41
  Top 0.813: 9.65,30.35 6.86,30.35 | 9.65,30.35 10.03,30.35 | 10.03,30.35 12.06,30.35 | 12.06,30.35 13.84,30.35 | 13.84,30.35 16.13,30.35 16.89,31.11 C2.1 | C4.1 9.65,30.35 | 6.67,30.55 6.86,30.35 | 12.13,30.42 12.06,30.35 | 14.03,30.54 13.84,30.35 | 4.76,30.41 4.83,30.35 6.86,30.35 | L2.2 7.16,23.46 10.03,26.22 10.03,30.35
COM12V
  Top 0.813: L1.1 48.43,1.65 | D1.C 4.25,13.51 C62.1 C61.1 4.25,21.69 L2.1
  Top 1.016: 48.43,1.65 11.43,1.65 11.43,5.71 D1.C
D3V3  (via drill 0.35 pad 1.3)
  Top 0.457: 64.14,21.15 T2.3
  Top 0.813: 65.56,15.08 R45.1 | 65.56,15.08 67.06,15.08 67.44,14.7 67.44,10.79 63.5,10.79 61.59,8.89 JP3.4 | 65.56,15.08 64.14,15.08 T2.3 | R47.1 65.08,22.1 64.14,21.15 | T1.2 54.36,13.97 v54.23,14.1
  Bottom 0.813: v54.23,14.1 61.72,14.1 | 61.72,14.1 L8.1 | JP3.4 61.59,13.97 61.72,14.1
D12V
  Top 0.508: U2.1 45.47,12.63 | U2.3 46.73,10.67 45.47,10.67
  Top 0.813: 45.47,12.63 45.47,10.67 45.47,6.73 46.92,5.27 C3.1 50.55,5.27 | C1.1 52.09,5.16 51.98,5.27 50.55,5.27 | L1.2 50.38,5.11 50.55,5.27
GND  (via drill 0.35 pad 1.2, 0.35 pad 1.3)
  Top 0.508: 60.33,41.91 60.33,48.01 62.17,49.85 | 90.93,8.82 90.93,12.95 | U2.2 48.26,11.68 | 5.71,33.4 U4.2 | U3.2 13.08,33.4
  Top 0.813: C24.1 44.92,39.53 44.77,39.69 44.77,41.91 | C46.1 R48.2 R34.2 57.78,18.73 57.78,17.14 | R35.1 93.22,6.54 90.93,8.82 | C42.2 C43.2 116.2,6.39 L5.1 113.79,3.72 113.79,1.52 108.71,1.52 | U8.4 36.52,21.97 R60.1 39.05,26.16 40.95,26.16 | C23.1 44.77,41.91 | U6.11 29.84,41.91 44.77,41.91 | 44.77,41.91 56.52,41.91 | 56.52,41.91 U7.4 56.52,31.75 | 60.33,41.91 56.52,41.91 | 62.17,49.85 C27.2 | R62.1 40.95,26.16 | U5.20 U5.19 | 57.78,17.14 R46.2 | C15.1 C12.1 4.83,48.33 4.83,47.24 6.67,45.41 C14.2 10.03,44.45 | R63.1 R61.1 19.18,23.24 19.05,23.11 19.05,20.19 | 90.93,12.95 91.82,13.84 96.52,13.84 97.28,13.08 U5.20 | U5.20 97.41,10.67 97.41,7.49 | 97.41,7.49 97.41,4.45 | 97.41,4.45 97.41,1.14 108.71,1.14 108.71,1.52 | 108.71,1.52 108.71,17.27 107.88,17.27 C20.2 107.76,19.34 106.55,20.55 SW1.P$2 | C5.1 97.54,7.37 97.41,7.49 | C6.1 97.41,4.45 | L7.1 69.6,16 69.76,16.16 69.76,17.14 | 69.76,17.14 LED1.C | 48.26,9.02 48.26,7.3 C3.2 C1.2 53.09,7.17 54.99,5.27 R4.2 | 48.26,9.02 48.26,11.68 48.26,15.11 C9.2 48.33,16.07 49.4,17.14 57.78,17.14 | 5.71,33.4 9.53,33.4 | 9.65,33.4 13.08,33.4 16.57,33.4 C2.2 | 9.65,33.4 9.53,33.4 | C11.2 9.53,37.59 | 10.03,44.45 10.03,37.59 | v70.48,17.14 69.76,17.14 | v50.16,9.02 48.26,9.02 | 9.53,37.59 9.53,33.4 | C10.2 10.03,37.59 | 10.03,37.59 9.53,37.59 | 10.03,44.45 C13.2 12.13,45.41 14.22,47.5 14.22,48.19 C8.1 14.35,48.39 15.88,49.91 U1.2 | 9.65,33.4 C4.2 | 56.52,31.75 54.3,31.75 C30.1 53.98,31.75 52.07,29.84 52.07,20.43 R6.1 | C41.1 102.23,35.56 103.5,36.83 U9.11 | C52.2 42.29,9.27 43.19,10.17 43.19,24.9 41.93,26.16 40.95,26.16 | C53.2 19.05,9.27 19.05,20.19 | R5.1 18.92,20.32 19.05,20.19
  Top 0.813: C31.1 58.73,31.75 56.52,31.75 | JP1.1 6.6,1.78 2.67,1.78 1.46,2.98 1.46,16.13 | 1.46,16.13 1.46,19.05 C61.2 | C62.2 1.46,16.13
  Bottom 0.508: 45.72,1.4 45.72,1.91
  Bottom 0.61: 41.4,1.4 41.91,1.91
  Bottom 0.813: R57-MPX.3 95.89,53.47 99.57,53.47 | 99.57,53.47 108.33,53.47 | 108.33,53.47 117.32,53.47 117.32,47.37 117.2,47.24 JP4.2 115.19,44.7 112.71,42.23 104.64,42.23 C57.1 104.45,40.33 104.46,40.32 103.5,39.37 U9.11 103.5,32 100.84,29.34 95.38,29.34 | U5.20 97.28,8 97.85,7.43 C16.2 101.09,4.19 107.7,4.19 107.7,16.95 108.33,17.59 | C19.2 108.33,17.59 | 108.33,17.59 111.06,20.32 R59-RDS.3 | C7.1 108.33,53.47 | R74.2 99.57,53.47 | L4.1 83.02,30.77 84.45,29.34 95.38,29.34 | 45.72,1.4 50.16,1.4 v50.16,9.02 | U6.11 29.84,35.56 40.39,35.56 42.42,37.59 C55.1 | R72-VUR.3 41.91,1.91 | L6.1 28.83,1.4 | R58-PILOT.3 95.38,29.34 | C56.1 33.53,25.53 34.92,24.13 U8.4 | 28.83,1.4 14.86,1.4 R73-VUL.3 14.61,4.45 12.45,4.45 | 28.83,1.4 41.4,1.4 | JP1.1 12.45,4.45 | 12.32,8.26 JP7.2 12.32,15.24 | 12.32,8.26 12.32,4.57 12.45,4.45 | R5.1 13.72,15.24 12.32,15.24 | C59.1 12.25,15.31 12.32,15.24 | C60.2 12.45,8.13 12.32,8.26
  Bottom 2.032: 41.91,1.91 45.72,1.91
  other vias: 1.27,1.27 116.84,54.61
  pour Bottom (isolate 1.016): 44.2,0.13 44.2,13.34 47,16.14 55.24,16.26 55.24,26.8 55.63,27.18 118.49,27.18 118.49,0.13
  pour Bottom (isolate 1.016): 42.55,0.13 0,0.13 0,56.13 118.49,56.13 118.49,28.96 53.34,28.96 53.34,17.55 45.72,17.4 42.66,14.34
  pour Top (isolate 1.016): 0,-0.13 0,55.75 118.11,55.75 118.11,30.35 115.57,27.81 55.88,27.81 54.61,26.54 54.61,18.92 44.45,18.92 44.45,-0.13
L_IN
  Bottom 0.813: 8.68,17.14 L10.1 | R5.3 8.71,17.18 L10.1 | L10.1 8.74,17.21 C59.2
L_SENSE
  Top 0.508: 26.04,51.75 26.04,43.05
  Top 0.813: U6.7 22.1,45.85 22.1,51.69 22.16,51.75 R10.1 26.04,51.75 R12.2 | 26.04,43.05 24.38,41.4 21.46,41.4 20.57,40.51 20.57,36.58 21.97,35.18 21.97,30.1 26.29,30.1 27.62,28.76 C48.1
MPX
  Top 0.813: R54.1 93.03,45.72 U9.7
  Bottom 0.813: R57-MPX.1 90.81,46.48 95.12,46.48 U9.7
N#222
  Top 0.813: U2.5 50.42,12.63 | 50.42,12.63 50.61,12.63 52.09,11.15 T1.1 | C9.1 50.23,12.83 50.42,12.63
N$1
  Bottom 0.813: C16.1 101.15,9.27 | 101.15,9.27 102.74,9.27 X1.2 | U5.3 92.2,15.88 94.49,13.59 100.33,13.59 101.15,12.77 101.15,9.27
N$2
  Bottom 0.813: X1.1 105.09,11.81 C19.1 95.44,15.69 94.74,16.38 U5.2
N$3
  Top 0.813: U5.11 72.14,13.08 72.14,19.18 70.17,21.15 R23.1
N$4
  Top 0.813: R25.1 78.55,3.94 80.97,3.94 R36.1 81.09,2.29 92.46,2.29 94.11,3.94 R35.2
N$5
  Top 0.813: R26.1 83.38,6.35 83.38,4.45 R36.2 R37.1
N$6
  Top 0.508: 88.39,14.61 88.39,9.27 90.61,7.05 | 75.69,20.95 75.69,15.62
  Top 0.813: R37.2 90.68,4.06 90.68,6.54 R27.1 90.61,7.05 | R38.1 68.27,24.89 71.5,24.89 71.75,24.64 71.75,21.46 72.26,20.95 75.69,20.95 | 88.39,14.61 76.71,14.61 75.69,15.62
N$7
  Top 0.813: R38.2 R39.1 R28.1
N$8
  Top 0.813: R39.2 R40.1 R29.1
N$9
  Top 0.813: R40.2 R41.1 83.5,25.71 85.02,24.2 R30.1
N$10
  Top 0.813: R41.2 R42.1 88.58,25.65 89.72,24.52 R31.1
N$11
  Top 0.813: R42.2 R43.1 93.67,25.4 94.36,24.7 94.36,23.56 R32.1
N$12
  Top 0.813: R25.2 80.45,7.17 82.04,8.76 U5.14
N$13
  Top 0.813: U5.15 84.58,9.53 85.47,8.64 85.47,6.67 R26.2
N$14
  Top 0.813: R27.2 87.12,8.19 U5.16
N$15
  Top 0.813: U5.9 76.96,22.1 76.2,22.86 R28.2
N$16
  Top 0.813: R29.2 80.33,21.59 79.5,20.77 U5.8
N$17
  Top 0.813: U5.7 82.04,20.76 83.12,21.84 R30.2
N$18
  Top 0.813: R31.2 87.82,22.61 84.58,19.36 U5.6
N$19
  Top 0.61: U5.5 87.12,19.05 89.79,21.72 90.68,21.72 92.46,23.5 R32.2
N$20
  Top 0.813: C39.1 R43.2
N$21
  Bottom 0.813: U7.11 56.52,46.99 R22.3
N$22
  Top 0.813: R60.2 41.27,24.19 41.27,23.24 40.77,22.73 39.62,22.73 38.8,21.91 38.8,20.95 R67.1 39.05,19.81 36.13,16.89 U8.2
N$23
  Top 0.813: R23.2 68.27,20.13 67.66,19.52 LED1.A
N$24
  Top 0.813: D2.A 35.96,14.35 U8.1
N$25
  Top 0.813: R67.2 41.01,20.65 D2.C 41.01,16.49 39.05,14.54 R69.1
N$26
  Top 0.813: U8.3 31.75,19.43 31.75,22.8 36.89,27.94 | R62.2 36.89,27.94 | 36.89,27.94 C47.2
N$27
  Top 0.813: R5.2 11.21,22.01 13.08,23.88 17.78,23.88 19.43,25.53 19.43,35.81 18.68,36.57 18.68,37.65 C17.1
N$28
  Top 0.813: U8.6 23.24,19.43 23.24,19.5 | R61.2 23.24,23.18 23.24,19.5 | R68.1 23.24,19.5
N$29
  Top 0.813: R7.2 C17.2
N$30
  Top 0.813: R7.1 19.56,45.4 21.78,43.18 23.5,43.18 24.77,44.45 U6.6 24.77,49.09 R10.2
N$31
  Top 0.813: U1.3 17.91,52.45 14.29,52.45 R1.1 13.97,52.14 13.97,51.05 12.13,49.22 C8.2
N$32
  Top 0.813: C21.1 R15.2 31.56,51.75 29.59,49.78 28.64,49.78 R12.1
N$33
  Top 0.813: C23.2 41.59,44.45 40.33,43.18 32.38,43.18 U6.3 R15.1
N$34
  Top 0.813: U6.2 U6.1 37.47,48.01 38.1,48.64 38.1,49.53 | C21.2 36.52,49.53 38.1,49.53 | 38.1,49.53 39.69,49.53 R17.2
N$35
  Top 0.813: R19.2 C25.2 43.88,52.2 40.45,52.2 R17.1
N$36
  Top 0.813: R19.1 46.03,52.26 | 46.03,52.26 C25.1 | C28.1 49.53,52.26 46.03,52.26
N$37
  Top 0.813: U7.14 48.9,47.62 49.78,48.51 C28.2
N$38
  Bottom 0.813: C18.1 33.59,33.15 45.09,33.15 49.74,28.49 R6.2
N$39
  Bottom 0.813: R8.2 C18.2
N$40
  Top 0.813: U6.9 24.77,34.36 R11.2
  Bottom 0.813: R8.1 24.77,34.86 U6.9
N$41
  Top 0.813: U4.5 C11.1 4.76,38.29 6.67,40.19 R3.1
N$42
  Top 0.813: C22.1 R16.2 31.56,32.07 29.87,33.75 29.07,33.75 R13.1
N$43
  Top 0.813: R16.1 U6.12 32.38,40.64 40.33,40.64 41.59,39.37 C24.2
N$44
  Top 0.813: R18.2 C22.2 36.2,38.1 | 36.2,38.1 U6.13 | U6.14 36.2,38.1
N$45
  Top 0.813: R18.1 40.07,31.88 R20.2 C26.2
N$46
  Top 0.813: C26.1 R20.1 46.23,32.07 C29.1
N$47
  Top 0.813: C29.2 48.9,35.24 U7.1
N$48
  Top 0.813: U7.3 C30.2
N$49
  Top 0.813: C31.2 U7.5
N$50
  Top 0.813: C35.2 64.96,37.28 U7.7
N$51
  Top 0.813: XTAL1.2 62.48,30.93 C35.1
N$52
  Top 0.813: XTAL1.1 61.59,35.31 U7.6
N$53
  Bottom 0.813: R22.1 53.98,49.53 U7.12
N$54
  Top 0.813: U8.7 23.99,16.89 D3.A
N$55  (via drill 0.35 pad 1.2)
  Top 0.813: R44.1 70.17,39.94 v71.88,38.23 84.9,38.23 | C41.2 84.9,38.23 | 84.9,38.23 C45.1
  Bottom 0.813: v71.88,38.23 71.88,32.26 73.41,30.73 76.45,30.73 L4.3
N$56
  Top 0.813: C34.1 68.77,36.83 66.67,36.83 66.67,45.72 | 66.67,45.72 66.67,46.48 66.74,46.54 C37.2 | U7.8 66.67,45.72
N$57
  Top 0.813: R44.2 C37.1
N$58
  Top 0.508: 62.99,48.26 61.59,46.86 U7.9
  Top 0.813: 62.99,48.26 67.94,48.26 69.22,49.53 C32.2
N$59
  Top 0.813: C32.1 R24.2
N$60  (via drill 0.35 pad 1.2)
  Top 0.813: R24.1 73.03,49.85 | C36.1 75.88,49.66 C33.2 75.82,50.1 73.03,50.1 73.03,49.85 | v73.41,47.88 73.03,48.26 73.03,49.85
  Bottom 0.813: L3.1 76.49,46.95 75.44,48.01 73.53,48.01 v73.41,47.88
N$61
  Top 0.813: R51.1 R55.2 93.92,40.64 97.16,40.64 98.42,39.37 U9.9
N$62
  Top 0.813: U9.6 98.42,44.45 97.22,43.25 92.96,43.25 R54.2 R50.1
N$63
  Top 0.813: R56.2 R53.1 113.22,38.41 113.03,38.23 113.03,36.07 112.78,35.81 109.09,35.81 108.58,36.32 U9.13
N$64
  Top 0.813: R50.2 86.36,48.58 C44.2
N$65
  Top 0.813: R51.2 89.09,37.08 88.65,37.08 86.8,38.93 C45.2
N$66  (via drill 0.35 pad 1.2)
  Top 0.813: v93.34,48.51 93.85,49.02 C49.1
  Bottom 0.813: v93.34,48.51 R57-MPX.2
N$67  (via drill 0.35 pad 1.2)
  Top 0.813: C50.1 100.65,33.4 v98.81,33.4
  Bottom 0.813: v98.81,33.4 92.71,33.4 92.71,31.88 R58-PILOT.2
N$68  (via drill 0.35 pad 1.2)
  Top 0.813: C51.1 v112.01,28.96
  Bottom 0.813: R59-RDS.2 112.01,22.86 v112.01,28.96
N$69
  Top 0.813: R64.2 103.83,49.04 C49.2
N$70
  Top 0.813: R65.2 C50.2
N$71
  Top 0.813: R66.2 109.16,31.56 111.06,33.46 C51.2
N$72
  Top 0.508: 107.31,40.64 107.31,34.86
  Top 0.813: R64.1 108.58,51.94 | 108.58,51.94 R71.2 | 108.58,51.94 U9.2 108.58,41.91 107.31,40.64 | R65.1 R66.1 108.33,33.84 107.31,34.86
N$73
  Top 0.813: R68.2 21.23,19.38 D3.C 21.23,15.86 23.18,13.91 R70.1
N$74
  Top 0.813: C34.2 R33.1
N$75
  Top 0.813: R53.2 C58.1
N$76  (via drill 0.35 pad 1.2)
  Top 0.813: v36.7,9.14 38.93,9.14 C52.1 39.05,10.1 40.95,12 R69.2
  Bottom 0.813: R72-VUR.1 36.7,4.95 v36.7,9.14
N$77  (via drill 0.35 pad 1.2)
  Top 0.813: v23.37,5.46 23.37,9.08 C53.1 23.18,10.23 21.27,12.13 R70.2
  Bottom 0.813: v23.37,5.46 22.61,4.7 R73-VUL.1
N$78
  Top 0.813: R52.2 110.49,8.89 113.62,8.89 L5.2
N$79
  Top 0.813: R71.1 111.12,51.5 U9.1
  Bottom 0.813: U9.1 111.12,48.26 102.62,48.26 102.62,49.85 C54.1
N$80
  Bottom 0.813: JP7.3 8.64,13.08 L10.2
N$81
  Bottom 0.813: L11.1 JP7.1
N$82
  Top 0.508: U3.5 12.13,35.37
  Top 0.813: 12.13,35.37 12.83,36.07 13.59,36.07 14.03,36.51 C10.1 14.03,38.29 12.13,40.19 R2.1
N$83
  Top 0.813: R33.2 65.21,26.67 R49.1 66.67,25.08 66.67,20.47 65.85,19.64 T2.1
N$84
  Top 0.813: R48.1 R47.2 R49.2 C46.2
N$85
  Top 0.813: R4.1 55.88,8.66 T1.3
N$86
  Bottom 0.813: R57.1 17.78,3.17 17.4,3.56 R73-VUL.2
N$87
  Top 0.813: T2.2 63.14,19.05 61.59,19.05 | 61.59,19.05 R34.1 | C38.1 61.59,19.05
N$88
  Bottom 0.813: R58.2 38.73,3.17 39.37,3.81 R72-VUR.2
N$89
  Bottom 0.813: R74.1 100.14,49.98 102.04,51.88 C54.2 R75.1
N$90
  Bottom 0.813: R75.2 C7.2 109.96,49.98 L9.2
N$91
  Bottom 0.813: JP4.1 113.92,51.05 L9.1
N$99  (via drill 0.35 pad 1.2)
  Top 0.813: C44.1 85.91,52.2 C40.2 C36.2 81.88,49.56 82.14,49.56 v83.82,47.88
  Bottom 0.813: L3.3 80.52,45.9 80.52,48.01 83.69,48.01 v83.82,47.88
N$277
  Top 0.813: R63.2 23.37,27.75 23.37,25.78 23.5,25.65 27.3,25.65 | 27.3,25.65 29.46,25.65 29.52,25.71 C48.2 | U8.5 27.3,25.65
PIC3V3
  Top 0.813: U5.17 89.66,13.97 91.57,15.88 97.28,15.88 | 97.28,15.88 U5.1 | C6.2 C5.2 101.03,15.88 | 101.03,15.88 101.03,22.73 R9.1 | 97.28,15.88 101.03,15.88
  Bottom 0.813: L8.2 88.27,14.1 89.66,12.7 U5.17
PILOT
  Top 0.813: R55.1 92.68,37.5 92.96,37.21 95,37.21 U9.8
  Bottom 0.813: R58-PILOT.1 90.3,36.45 92.08,38.23 95.76,38.23 U9.8
PILOT_REF
  Top 0.813: R45.2 C38.2 R46.1 58.42,12.38 58.42,1.91 59.18,1.14 96.01,1.14 96.01,8.13 93.6,8.13 92.2,9.53 U5.18
R_IN
  Bottom 0.813: C60.1 19.87,11.91 L11.2 36.7,11.94 45.02,20.26 R6.3
R_SENSE
  Top 0.813: U6.8 22.23,37.02 23.24,36.01 23.24,31.75 24.7,31.75 R11.1 R13.2 28.83,31.56 30.42,29.97 33.02,29.97 33.98,29.02 C47.1
RDS
  Top 0.813: U9.14 111.12,40.78 113,43.62 R56.1
  Bottom 0.813: R59-RDS.1 113.67,35.56 U9.14
RDS_DAC
  Top 0.813: C39.2 102.8,28.57 110.24,28.57 110.24,15.17 R52.1 C42.1 C43.1 116.95,15.67 116.95,28.59 115.32,30.23 C58.2
RST
  Top 0.61: 89.66,19.05 91.69,21.08 97.41,21.08 99,22.67
  Top 0.813: U5.4 89.66,19.05 | 103.5,24.77 99.31,24.77 99,24.45 R9.2 99,22.67 | 103.5,24.77 103.63,24.77 103.63,17.14 105.6,17.14 C20.1 | SW1.P$1 106.27,26.67 103.5,26.67 103.5,24.77
RXD
  Top 0.813: R21.2 76.83,4.06 76.96,4.19 U5.12
SGND
  Top 0.813: JP3.3 64.14,8.38 64.9,9.14 69.34,9.14 69.6,9.4 L7.2
SRXD
  Top 0.813: R21.1 70.23,4.06 JP3.1
STXD
  Top 0.813: JP3.2 66.67,7.62 72.46,7.62 R14.2
TXD
  Top 0.508: 75.69,8.64 75.69,12.83
  Top 0.813: U5.10 74.42,14.1 75.69,12.83 | R14.1 75.37,8.32 75.69,8.64
VGND
  Bottom 0.813: L6.2 28.79,6.44 JP6.2
VREF  (via drill 0.35 pad 1.3)
  Top 0.813: U9.10 100.97,41.91 | 100.97,41.91 U9.5 | U9.3 106.05,41.91 | 106.05,41.91 U9.12 | 100.97,41.91 106.05,41.91 | U6.5 U6.10 | C12.2 C15.2 9.53,52.2 | 9.53,52.2 R1.2 | v9.53,46.23 9.53,52.2
  Bottom 0.813: U9.5 100.97,45.34 98.81,43.18 86.61,43.18 86.61,50.42 70.48,50.42 70.48,44.58 68.96,43.05 45.34,43.05 38.99,49.4 27.3,49.4 | v9.53,46.23 19.3,46.23 22.48,49.4 27.3,49.4 | U6.5 27.3,49.4
VU_L
  Bottom 0.813: R57.2 26.35,6.42 JP6.3
VU_R
  Bottom 0.813: R58.1 31.43,6.41 JP6.1

### Text on the board
Bottom: RDS Stereo / MFINI 2025
tDocu: SUBCARRIER / BALANCE | MPX | + / AUDIO_OUT / - | PILOT | RDS | + 12V - | VU LEFT | VU RIGHT | L VU_OUT R | L AUDIO_IN R